# EAGLE schematic Planto Manager Wiring (EAGLE 9.6.2)
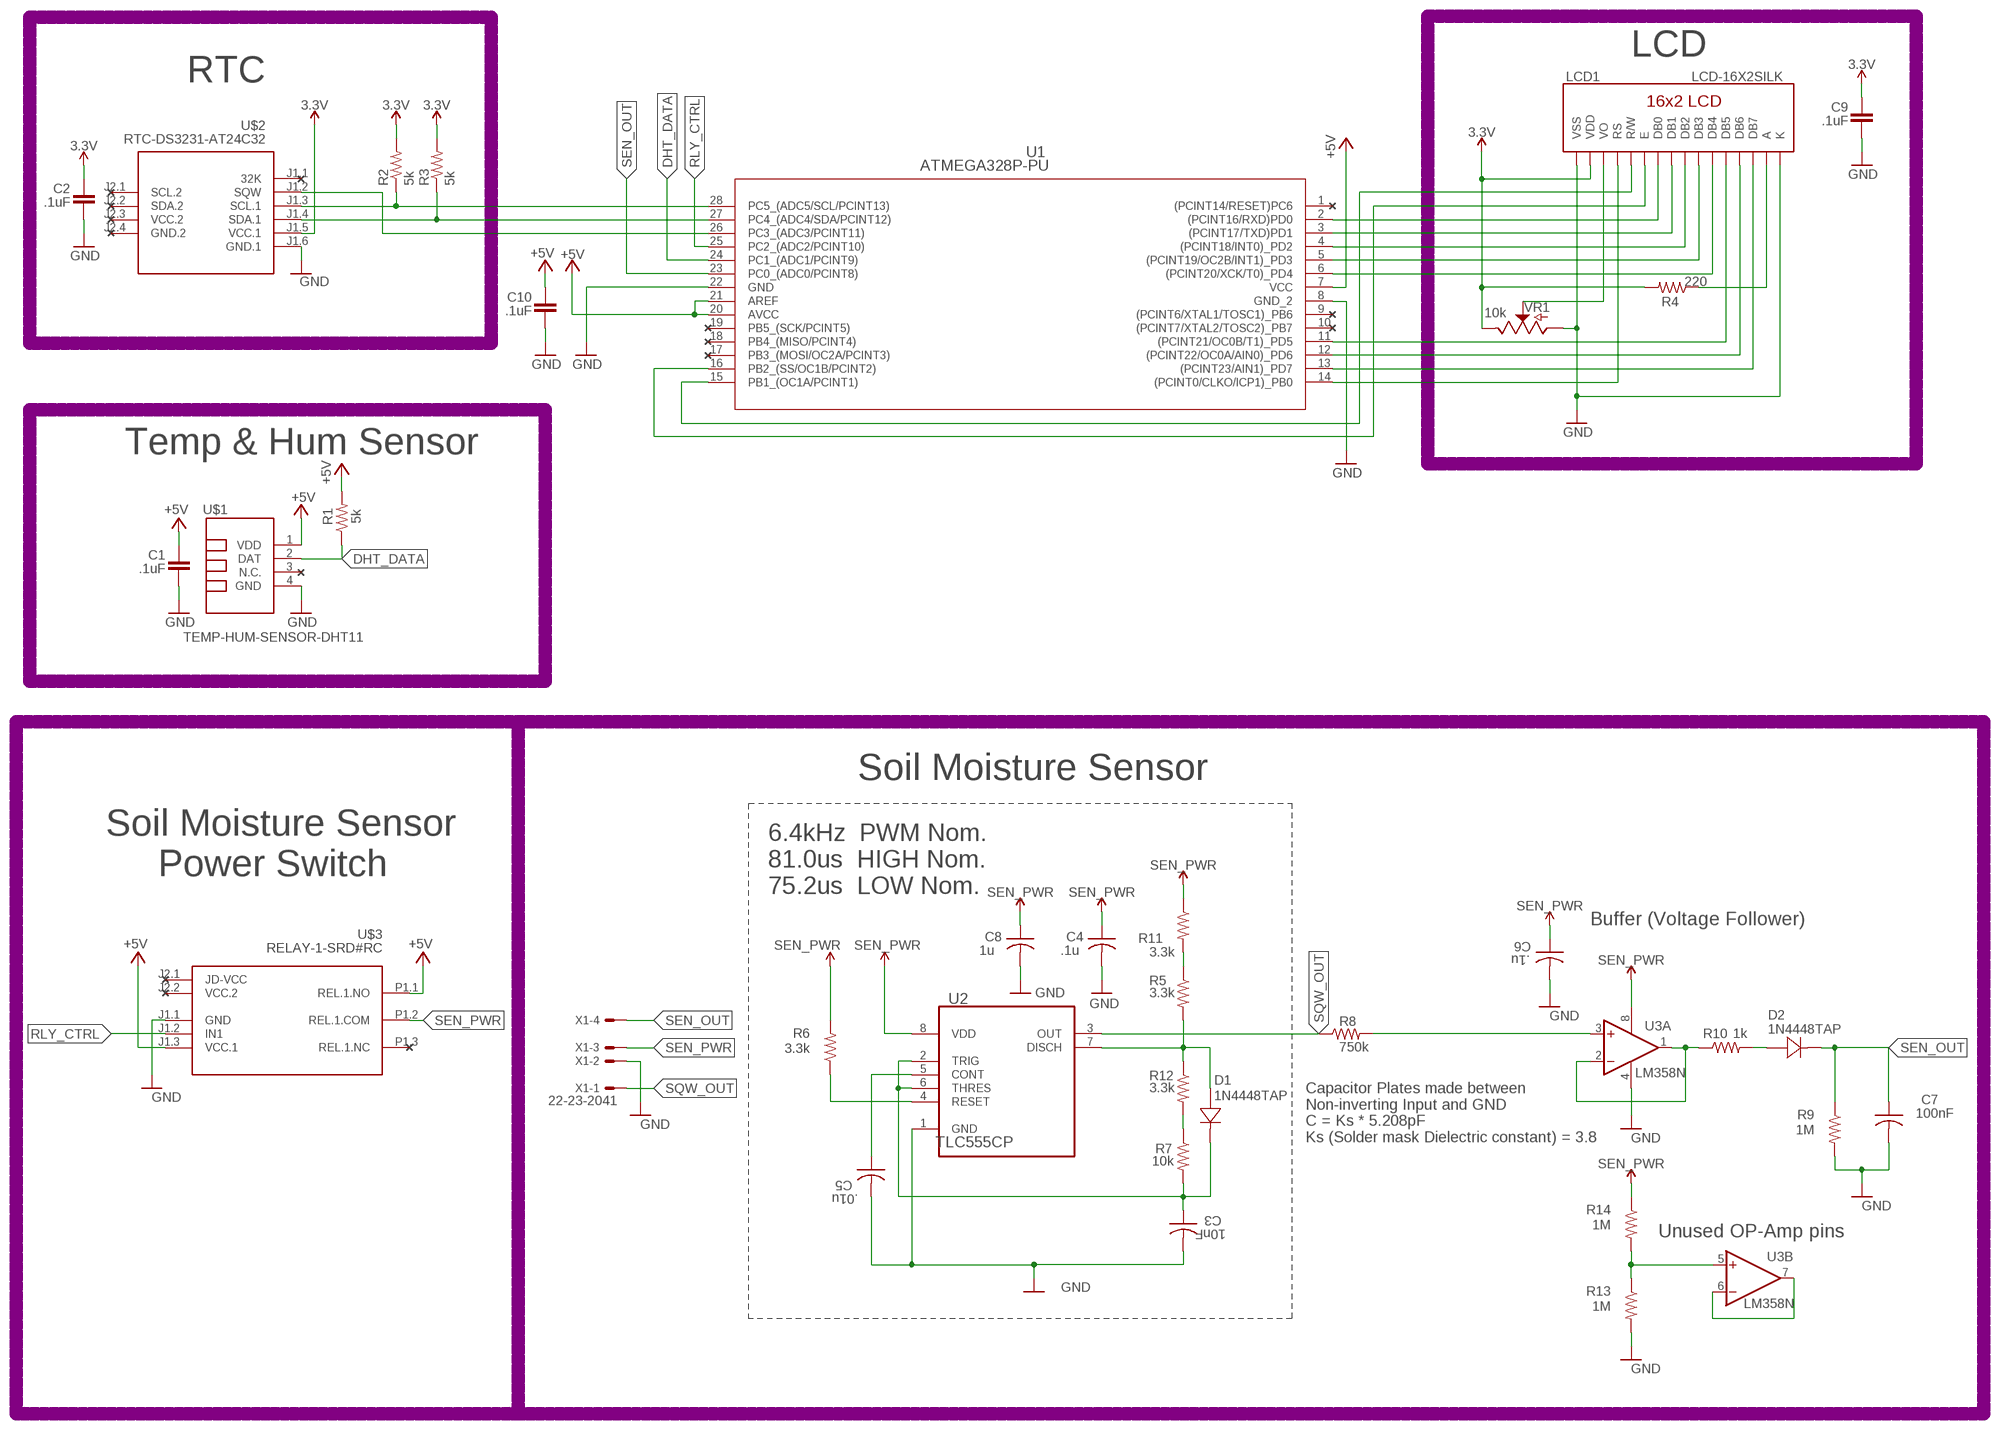
[diagram p0: schematic, sheet 1]

## Parts
C1  .1uF  C-EUC0805  [C0805]
C2  .1uF  C-EUC0805  [C0805]
C3  10nF  C-USC1206  [C1206]
C4  .1u  C-USC1206  [C1206]
C5  .01u  C-USC1206  [C1206]
C6  .1u  C-USC1206  [C1206]
C7  100nF  C-USC1206  [C1206]
C8  1u  C-USC1206  [C1206]
C9  .1uF  C-EUC0805  [C0805]
C10  .1uF  C-EUC0805  [C0805]
D1  1N4448TAP  [DO-35]
D2  1N4448TAP  [DO-35]
LCD1  LCD-16X2SILK  [LCD-16X2]
R1  5k  R-US_R0805  [R0805]
R2  5k  R-US_R0805  [R0805]
R3  5k  R-US_R0805  [R0805]
R4  220  R-US_R0805  [R0805]
R5  3.3k  R-US_R1206  [R1206]
R6  3.3k  R-US_R1206  [R1206]
R7  10k  R-US_R1206  [R1206]
R8  750k  R-US_R1206  [R1206]
R9  1M  R-US_R1206  [R1206]
R10  1k  R-US_R1206  [R1206]
R11  3.3k  R-US_R1206  [R1206]
R12  3.3k  R-US_R1206  [R1206]
R13  1M  R-US_R1206  [R1206]
R14  1M  R-US_R1206  [R1206]
U1  ATMEGA328P-PU  [28P3_ATM]
U2  TLC555CP  [DIP254P762X508-8]
U3  LM358N  [DIL08]
U$1  TEMP-HUM-SENSOR-DHT11  [TEMP-HUM-SENSOR-DHT11]
U$2  RTC-DS3231-AT24C32  [RTC-DS3231-AT24C32]
U$3  RELAY-1-SRD#RC  [RELAY-1-SRD#RC]
VR1  10k  POTENTIOMETER-PTH-9MM-1/20W-20%-KIT  [POT-PTH-ALPS-KIT]
X1  22-23-2041  [22-23-2041]

## Nets
3.3V: C2.2 C9.2 LCD1.2(VDD) R2.2 R3.2 R4.2 U$2.J1.5(VCC.1) VR1.P$1(E)
+5V: C1.2 C10.2 R1.2 U1.7(VCC) U1.20(AVCC) U1.21(AREF) U$1.1(VDD) U$3.J1.3(VCC.1) U$3.P1.1(REL.1.NO)
DHT_DATA: R1.1 U1.24(PC1_(ADC1/PCINT9)) U$1.2(DAT)
GND: C1.1 C2.1 C3.2 C4.2 C5.2 C6.2 C7.2 C8.2 C9.1 C10.1 LCD1.1(VSS) LCD1.16(K) R9.2 R13.2 U1.8(GND_2) U1.22(GND) U2.1(GND) U3.4(P:V-) U$1.4(GND) U$2.J1.6(GND.1) U$3.J1.1(GND) VR1.P$3(A) X1.2
LCD_E: LCD1.6(E) U1.16(PB2_(SS/OC1B/PCINT2))
LCD_RW: LCD1.5(R/W) U1.15(PB1_(OC1A/PCINT1))
N$2: LCD1.7(DB0) U1.2((PCINT16/RXD)PD0)
N$3: R2.1 U1.28(PC5_(ADC5/SCL/PCINT13)) U$2.J1.3(SCL.1)
N$4: R3.1 U1.27(PC4_(ADC4/SDA/PCINT12)) U$2.J1.4(SDA.1)
N$5: U1.26(PC3_(ADC3/PCINT11)) U$2.J1.2(SQW)
N$6: LCD1.8(DB1) U1.3((PCINT17/TXD)PD1)
N$7: LCD1.9(DB2) U1.4((PCINT18/INT0)_PD2)
N$8: LCD1.10(DB3) U1.5((PCINT19/OC2B/INT1)_PD3)
N$9: LCD1.11(DB4) U1.6((PCINT20/XCK/T0)_PD4)
N$10: LCD1.12(DB5) U1.11((PCINT21/OC0B/T1)_PD5)
N$11: LCD1.13(DB6) U1.12((PCINT22/OC0A/AIN0)_PD6)
N$12: LCD1.14(DB7) U1.13((PCINT23/AIN1)_PD7)
N$13: LCD1.4(RS) U1.14((PCINT0/CLKO/ICP1)_PB0)
N$14: LCD1.3(VO) VR1.P$2(S)
N$15: LCD1.15(A) R4.1
N$16: R6.1 U2.4(RESET)
N$17: C5.1 U2.5(CONT)
N$18: R8.2 U3.3(A:+IN)
N$19: R10.1 U3.1(A:OUT) U3.2(A:-IN)
N$20: C3.1 D1.1 R7.2 U2.2(TRIG) U2.6(THRES)
N$21: D2.2 R10.2
N$22: R7.1 R12.2
N$23: R5.1 R11.2
N$24: D1.2 R5.2 R12.1 U2.7(DISCH)
N$25: U3.6(B:-IN) U3.7(B:OUT)
N$26: R13.1 R14.2 U3.5(B:+IN)
RLY_CTRL: U1.25(PC2_(ADC2/PCINT10)) U$3.J1.2(IN1)
SEN_OUT: C7.1 D2.1 R9.1 U1.23(PC0_(ADC0/PCINT8)) X1.4
SEN_PWR: U$3.P1.2(REL.1.COM) X1.3
SQW_OUT: R8.1 U2.3(OUT) X1.1
VCC: C4.1 C6.1 C8.1 R6.2 R11.1 R14.1 U2.8(VDD) U3.8(P:V+) ; supply symbol labelled SEN_PWR
Unconnected: U1.1((PCINT14/RESET)PC6) U1.9((PCINT6/XTAL1/TOSC1)_PB6) U1.10((PCINT7/XTAL2/TOSC2)_PB7) U1.17(PB3_(MOSI/OC2A/PCINT3)) U1.18(PB4_(MISO/PCINT4)) U1.19(PB5_(SCK/PCINT5)) U$1.3(N.C.) U$2.J1.1(32K) U$2.J2.1(SCL.2) U$2.J2.2(SDA.2) U$3.J2.1(JD-VCC) U$3.P1.3(REL.1.NC)

## Notes on the sheet
- LCD
- RTC
- Temp & Hum Sensor
- Soil Moisture Sensor
- Soil Moisture Sensor
       Power Switch
- 6.4kHz  PWM Nom.
  81.0us  HIGH Nom. 
  75.2us  LOW Nom.
- Buffer (Voltage Follower)
- Capacitor Plates made between 
  Non-inverting Input and GND
  C = Ks * 5.208pF
  Ks (Solder mask Dielectric constant) = 3.8
- Unused OP-Amp pins

## Power pins joined to a net without a drawn wire
GND.2: U$2.J2.4(GND.2)
VCC.2: U$2.J2.3(VCC.2) U$3.J2.2(VCC.2)

## Library data of the parts
C1 C2 C9 C10 = rcl:C-EU: CAPACITOR, European symbol; SPICEPREFIX: C
C3-C8 = rcl:C-US: CAPACITOR, American symbol; SPICEPREFIX: C
D1 D2 = 1N4448TAP:1N4448TAP; BUILT_BY: EMA_UL_Team; MANUFACTURER_PART_NUMBER: 1N4448TAP; VENDOR: Vishay
LCD1 = SparkFun-Displays:LCD-16X2: Standard text-only 16x2 parallel input LCD Basic 16 character by 2 line display. Typically utilizes the extremely common HD44780 parallel interface chipset SparkFun Products: Basic 16x2 Green <https://www.sparkfun.com/products/255> Basic 8x2 Green <https://www.sparkfun.com/products/11122>; PROD_ID: LCD-12633; SF_ID: LCD-00255
R1-R14 = rcl:R-US_: RESISTOR, American symbol; SPICEPREFIX: R
U1 = ATMEGA328P-PU:ATMEGA328P-PU; BUILT_BY: EMA_UL_Team; MANUFACTURER_PART_NUMBER: ATMEGA328P-PU; SOURCELIBRARY: Atmel_2011-04-02; VENDOR: Atmel
U2 = TLC555CP:TLC555CP: LinCMOSE TIMERS; AVAILABILITY: Unavailable; DESCRIPTION: 555 Type, Timer/Oscillator _Single_ IC 2.1MHz 8-PDIP; MF: Texas Instruments; MP: TLC555CP; PACKAGE: PDIP-8 STMicroelectronics; PRICE: None
U3 = linear:LM358: OP AMP also LM158; LM258; LM2904 Source: http://cache.national.com/ds/LM/LM158.pdf
U$1 = diy-modules:TEMP-HUM-SENSOR-DHT11: DHT11 - digital humidity & temperature sensor DHT11 datasheet available here: https://akizukidenshi.com/download/ds/aosong/DHT11.pdf Click here to find device on ebay.com <http://www.ebay.com/sch/dht11+digital+sensor>
U$2 = diy-modules:RTC-DS3231-AT24C32: RTC Module with Battery and EEPROM based on DS3231 and AT24C32 chips Tutorial can be found here: https://edwardmallon.wordpress.com/2014/05/21/using-a-cheap-3-ds3231-rtc-at24c32-eeprom-from-ebay/ Click here to find device on ebay.com <http://www.ebay.com/sch/DS3231+AT24C32+module>
U$3 = diy-modules:RELAY-1-SRD#RC: 1-Channel Relay Module based on SRD-05VDC-SL-C relays Symbol with relays pins Click here to find device on ebay.com <http://www.ebay.com/sch/one+channel+isolated+relay+5v>
VR1 = SparkFun-Resistors:POTENTIOMETER: Potentiometer (Pot) Three-terminal potentiometers, with an adjustable wiper and two adjustable resistors. A pot can be used to create a configurable voltage divider, or as a variable resistor. Variants ALPS_POT and ALPS_POT_KIT - PTH, breadboard compatible, 9mm square pots Rotary Potentiometer - Linear (10k ohm) <https://www.sparkfun.com/products/9288> (COM-09288) The KIT variant exposes copper on only one side of the PTH pad, so the part can only be assembled on one side of the PCB. Useful for beginner soldering kits.; PROD_ID: RES-09177; SF_SKU: COM-09288
X1 = con-molex:22-23-2041: .100" (2.54mm) Center Header - 4 Pin; MF: MOLEX; MPN: 22-23-2041; OC_FARNELL: 1462920; OC_NEWARK: 38C0355